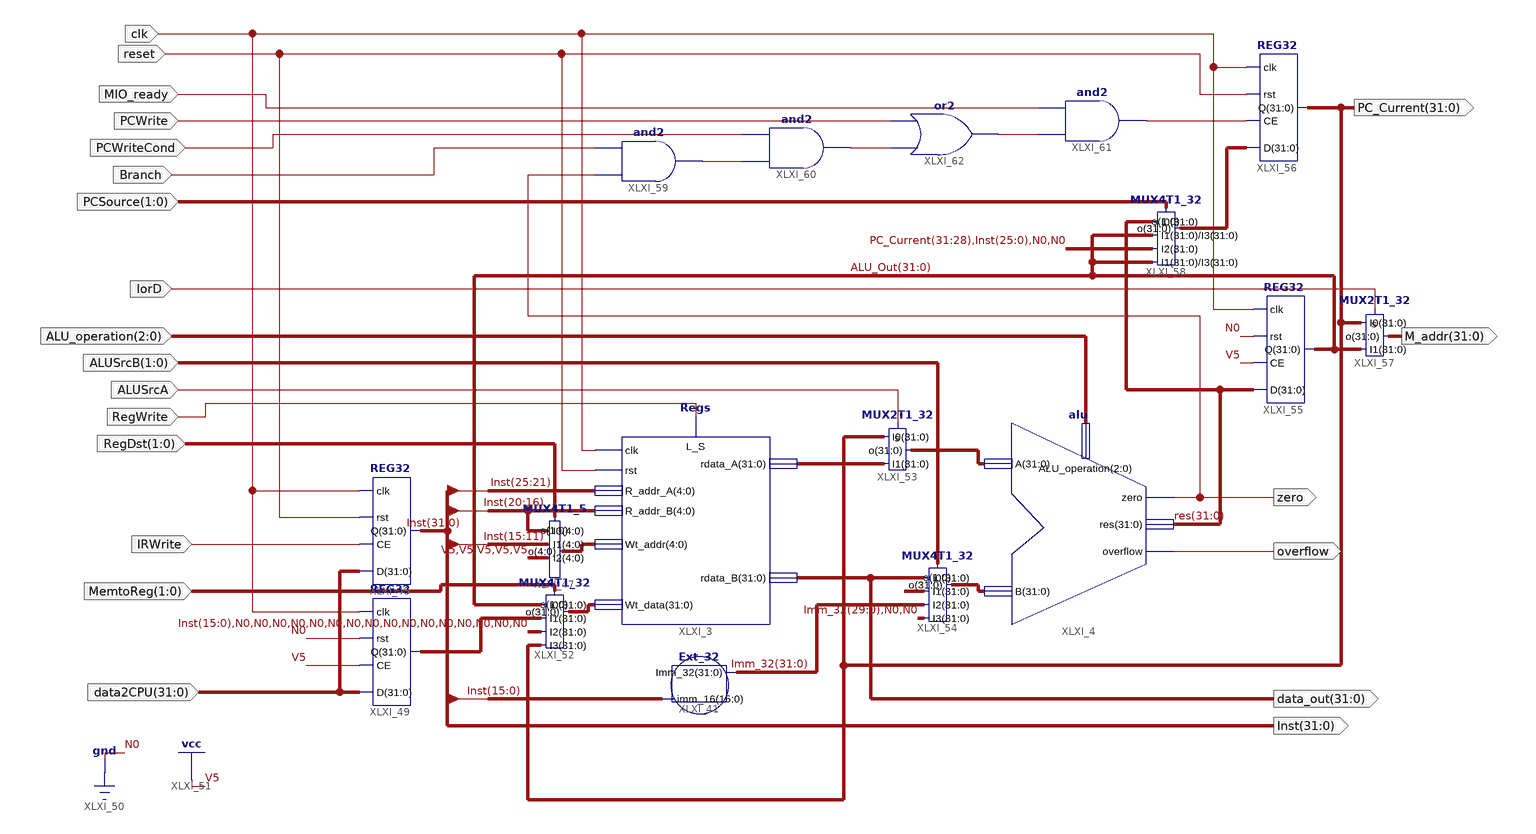
[diagram p0: schematic sheet 1]
// Xilinx ISE schematic MDPath.sch (kintex7) as structural Verilog: 17 symbols, 22 ports
module MDPath (
  input  clk,
  input  [2:0] ALU_operation,
  input  [1:0] ALUSrcB,
  input  RegWrite,
  input  reset,
  input  [1:0] RegDst,
  input  ALUSrcA,
  input  MIO_ready,
  input  PCWrite,
  input  PCWriteCond,
  input  Branch,
  input  [1:0] PCSource,
  input  IorD,
  input  IRWrite,
  input  [31:0] data2CPU,
  input  [1:0] MemtoReg,
  output zero,
  output overflow,
  output [31:0] data_out,
  output [31:0] Inst,
  output [31:0] PC_Current,
  output [31:0] M_addr
);

  wire XLXN_200, XLXN_202, XLXN_203, XLXN_205;
  wire [4:0] XLXN_118;
  wire [31:0] ALU_Out, Imm_32, res, XLXN_119, XLXN_126, XLXN_157, XLXN_164, XLXN_165, XLXN_194;

  Regs XLXI_3 (
    .clk(clk), .L_S(RegWrite), .rdata_A(XLXN_165), .rst(reset), .Wt_data(XLXN_119), .rdata_B(data_out),
    .R_addr_A(Inst[25:21]), .R_addr_B(Inst[20:16]), .Wt_addr(XLXN_118));
  alu XLXI_4 (.zero(zero), .res(res), .overflow(overflow), .A(XLXN_164), .B(XLXN_126), .ALU_operation(ALU_operation));
  Ext_32 XLXI_41 (.imm_16(Inst[15:0]), .Imm_32(Imm_32));
  MUX4T1_5 XLXI_47 (.s(RegDst), .I1(Inst[15:11]), .I0(Inst[20:16]), .o(XLXN_118), .I2({5{1'b1}}));  // open: I3
  REG32 XLXI_48 (.D(data2CPU), .CE(IRWrite), .rst(reset), .clk(clk), .Q(Inst));
  REG32 XLXI_49 (.D(data2CPU), .CE(1'b1), .rst(1'b0), .clk(clk), .Q(XLXN_157));
  MUX4T1_32 XLXI_52 (
    .s(MemtoReg), .I0(ALU_Out), .I1(XLXN_157), .I2({Inst[15:0], {16{1'b0}}}), .I3(PC_Current), .o(XLXN_119));
  MUX2T1_32 XLXI_53 (.s(ALUSrcA), .I0(PC_Current), .I1(XLXN_165), .o(XLXN_164));
  MUX4T1_32 XLXI_54 (
    .s(ALUSrcB), .I0(data_out), .I1(32'b00000000000000000000000000000100), .I2(Imm_32),
    .I3({Imm_32[29:0], 2'b00}), .o(XLXN_126));
  REG32 XLXI_55 (.D(res), .CE(1'b1), .rst(1'b0), .clk(clk), .Q(ALU_Out));
  REG32 XLXI_56 (.D(XLXN_194), .CE(XLXN_205), .rst(reset), .clk(clk), .Q(PC_Current));
  MUX2T1_32 XLXI_57 (.s(IorD), .I0(PC_Current), .I1(ALU_Out), .o(M_addr));
  MUX4T1_32 XLXI_58 (
    .s(PCSource), .I0(res), .I1(ALU_Out), .I2({PC_Current[31:28], Inst[25:0], 2'b00}), .I3(ALU_Out),
    .o(XLXN_194));
  and XLXI_59 (XLXN_200, zero, Branch);
  and XLXI_60 (XLXN_202, XLXN_200, PCWriteCond);
  and XLXI_61 (XLXN_205, XLXN_203, MIO_ready);
  or XLXI_62 (XLXN_203, XLXN_202, PCWrite);
endmodule
